# EAGLE design Untitled (EAGLE 6.6.0)
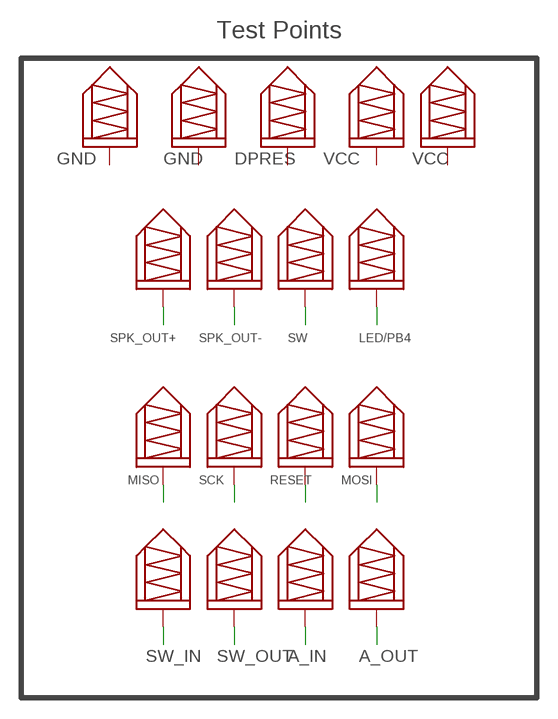
[diagram p0: schematic, sheet 1]

## Parts
A_IN  IDI-R2  [IDI-R2]
A_OUT  IDI-R2  [IDI-R2]
DPRES  IDI-R2  [IDI-R2]
DUTVCC1  IDI-R2  [IDI-R2]
DUTVCC2  IDI-R2  [IDI-R2]
GND2  IDI-R2  [IDI-R2]
GND11  IDI-R2  [IDI-R2]
LED  IDI-R2  [IDI-R2]
MISO  IDI-R2  [IDI-R2]
MOSI  IDI-R2  [IDI-R2]
RESET  IDI-R2  [IDI-R2]
SCK  IDI-R2  [IDI-R2]
SPK+  IDI-R2  [IDI-R2]
SPK-  IDI-R2  [IDI-R2]
SW_IN  IDI-R2  [IDI-R2]
SW_OUT  IDI-R2  [IDI-R2]
TACSW  IDI-R2  [IDI-R2]

## Nets
!RST: MISO.P$1
A_IN: A_IN.P$1
A_OUT: A_OUT.P$1
LED/PB4: LED.P$1
RESET: RESET.P$1
SCLK: SCK.P$1
SDIO: MOSI.P$1
SPK_OUT+: SPK+.P$1
SPK_OUT-: SPK-.P$1
SW: TACSW.P$1
SW_IN: SW_IN.P$1
SW_OUT: SW_OUT.P$1
Unconnected: DPRES.P$1 DUTVCC1.P$1 DUTVCC2.P$1 GND2.P$1 GND11.P$1

## Notes on the sheet
- Test Points
- GND | GND | DPRES | VCC | VCC
- MISO | SCK | RESET | MOSI

## Library data of the parts
A_IN A_OUT DPRES DUTVCC1 DUTVCC2 GND2 GND11 LED MISO MOSI RESET SCK SPK+ SPK- SW_IN SW_OUT TACSW = PR_Parts_Library:IDI-R2

## Net classes
1 antenna: clearance 1.27 mm

## Board
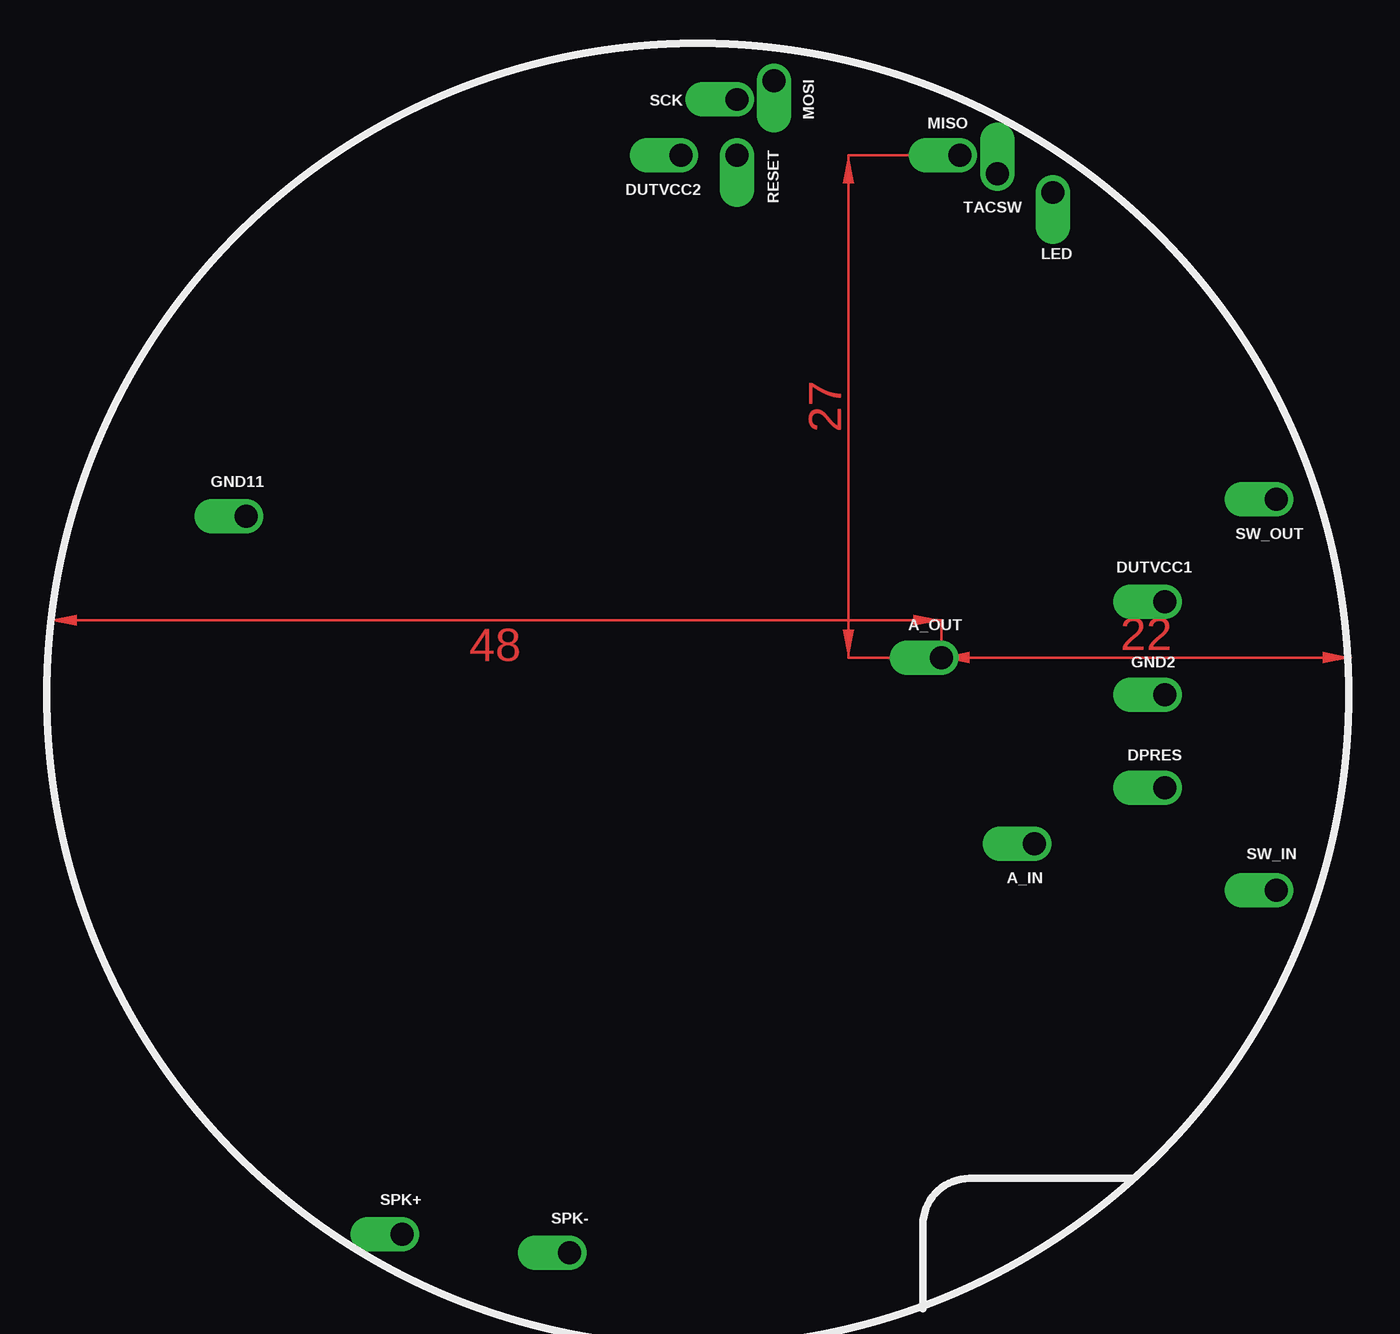
[diagram p1: board, top side]
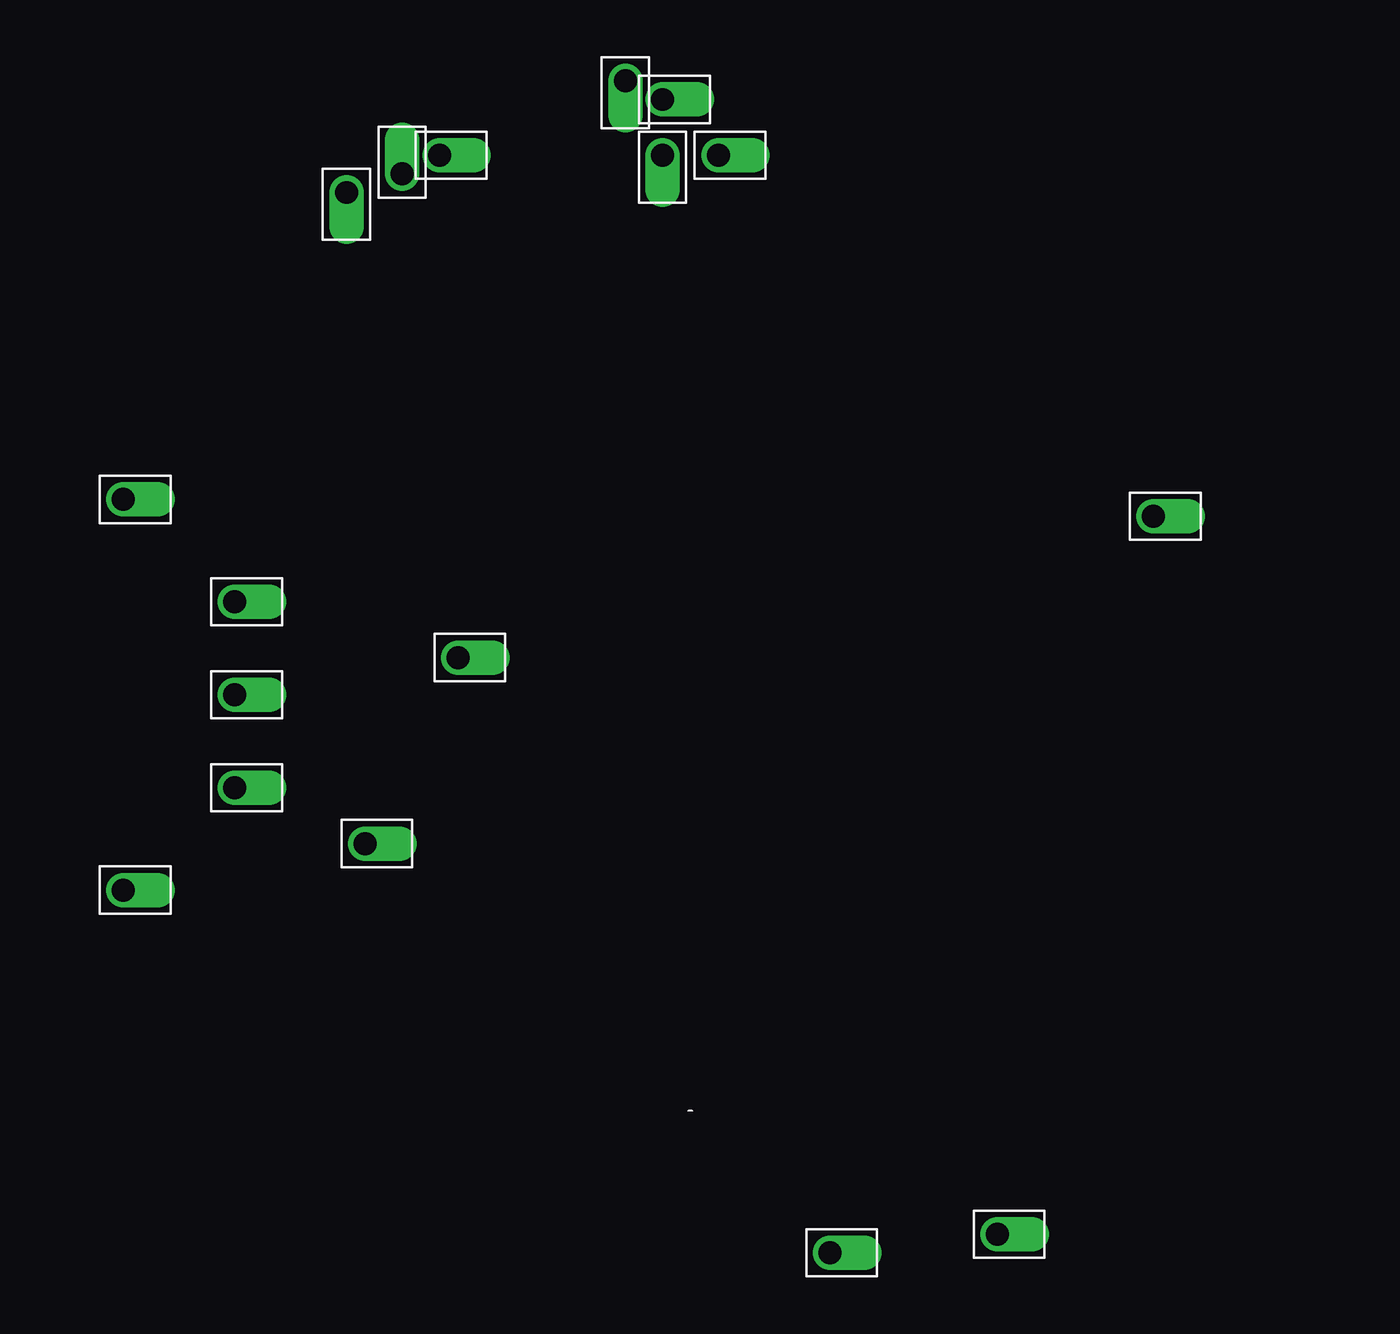
[diagram p2: board, bottom side, seen from below]

No outline drawn. Coordinates in mm, seen from the top.
Copper layers (1*16): Top 0.0356mm / dielectric 1.5011mm / Bottom 0.0356mm
Design rules "LaenPCBOrder *": minimum track width 6mil, minimum drill 13mil, track to track 6mil, track to pad 6mil, pad to pad 6mil, via to via 6mil, smd to smd 6mil, copper to edge 15mil, drill to drill 6mil, minimum pad ring 7mil, minimum via ring 5mil, stop-mask expansion 3mil, vias tented up to drill 0mil, thermal gap 10mil
tRestrict: area 26.1,56.1 to 27.7,57.7; 8 lines

### Footprints (pad centres in the part's own frame; a part is rotated, then mirrored left to right if it is on the bottom)
IDI-R2 = drill 1.232 pad 1.232 offset: P$1 0,0

### Placement (x,y rotation side)
A_IN  53,27 0 bottom
A_OUT  48,37 0 bottom
DPRES  60,30 0 bottom
DUTVCC1  60,40 0 bottom
DUTVCC2  34,64 0 bottom
GND2  60,35 0 bottom
GND11  10.6,44.6 0 bottom
LED  54,62 270 bottom
MISO  49,64 0 bottom
MOSI  39,68 270 bottom
RESET  37,64 270 bottom
SCK  37,67 0 bottom
SPK+  19,6 0 bottom
SPK-  28,5 0 bottom
SW_IN  66,24.5 0 bottom
SW_OUT  66,45.5 0 bottom
TACSW  51,63 90 bottom

### Tracks (layer width: path | path; a pad name or v marks a point on that pad's centre or on a via)
N$21
  pour Bottom: 
(copper drawn outside any net)
  shapes: Top area x3